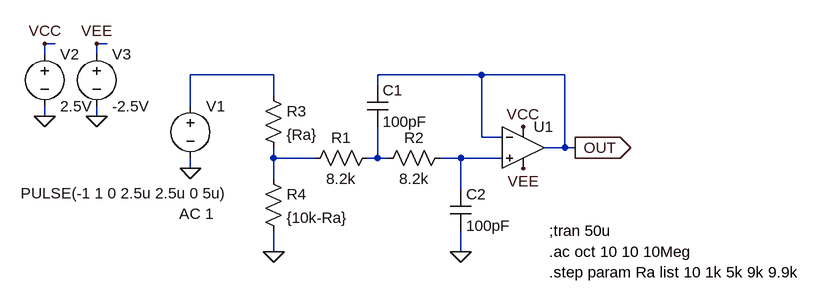
[diagram p0: schematic 2nd VCVS with POT.asc]
2nd VCVS with POT.asc, the LTspice schematic file:
Version 4
SHEET 1 880 680
WIRE -576 -64 -592 -64
WIRE -496 -64 -512 -64
WIRE -592 -48 -592 -64
WIRE -512 -48 -512 -64
WIRE -240 -16 -368 -16
WIRE 80 -16 -80 -16
WIRE 208 -16 80 -16
WIRE -80 0 -80 -16
WIRE -240 16 -240 -16
WIRE -368 32 -368 -16
WIRE -592 48 -592 32
WIRE -512 48 -512 32
WIRE 80 80 80 -16
WIRE 112 80 80 80
WIRE 208 96 208 -16
WIRE 208 96 176 96
WIRE 224 96 208 96
WIRE -240 112 -240 96
WIRE -176 112 -240 112
WIRE -80 112 -80 64
WIRE -80 112 -96 112
WIRE -64 112 -80 112
WIRE 48 112 16 112
WIRE 112 112 48 112
WIRE -368 128 -368 112
WIRE -240 144 -240 112
WIRE 48 160 48 112
WIRE -240 256 -240 224
WIRE 48 256 48 224
FLAG -368 128 0
FLAG 48 256 0
FLAG -592 48 0
FLAG -512 48 0
FLAG -592 -64 VCC
FLAG -512 -64 VEE
FLAG 144 64 VCC
FLAG 144 128 VEE
FLAG 224 96 OUT
IOPIN 224 96 Out
FLAG -240 256 0
SYMBOL Opamps\\UniversalOpamp2 144 96 R0
SYMATTR InstName U1
SYMBOL res -80 96 R90
WINDOW 0 0 56 VBottom 2
WINDOW 3 32 56 VTop 2
SYMATTR InstName R1
SYMATTR Value 8.2k
SYMBOL res 32 96 R90
WINDOW 0 0 56 VBottom 2
WINDOW 3 32 56 VTop 2
SYMATTR InstName R2
SYMATTR Value 8.2k
SYMBOL cap -96 0 R0
SYMATTR InstName C1
SYMATTR Value 100pF
SYMBOL cap 32 160 R0
SYMATTR InstName C2
SYMATTR Value 100pF
SYMBOL voltage -368 16 R0
WINDOW 123 -17 182 Left 2
WINDOW 39 0 0 Left 2
WINDOW 3 -261 150 Left 2
SYMATTR Value2 AC 1
SYMATTR Value PULSE(-1 1 0 2.5u 2.5u 0 5u)
SYMATTR InstName V1
SYMBOL voltage -592 -64 R0
WINDOW 123 0 0 Left 2
WINDOW 39 0 0 Left 2
SYMATTR InstName V2
SYMATTR Value 2.5V
SYMBOL voltage -512 -64 R0
WINDOW 123 0 0 Left 2
WINDOW 39 0 0 Left 2
SYMATTR InstName V3
SYMATTR Value -2.5V
SYMBOL res -256 0 R0
SYMATTR InstName R3
SYMATTR Value {Ra}
SYMBOL res -256 128 R0
SYMATTR InstName R4
SYMATTR Value {10k-Ra}
TEXT 184 224 Left 2 !;tran 50u
TEXT 184 256 Left 2 !.ac oct 10 10 10Meg
TEXT 184 288 Left 2 !.step param Ra list 10 1k 5k 9k 9.9k

The netlist it stands for:
* 2nd VCVS with POT.asc
XU1 N004 OUT VCC VEE OUT level.2 Avol=1Meg GBW=10Meg Slew=10Meg ilimit=25m rail=0 Vos=0 phimargin=45 en=0 enk=0 in=0 ink=0 Rin=500Meg  ; pins IN+ IN- V+ V- OUT
R1 N003 N002 8.2k
R2 N004 N003 8.2k
C1 OUT N003 100pF
C2 N004 0 100pF
V1 N001 0 PULSE(-1 1 0 2.5u 2.5u 0 5u) AC 1
V2 VCC 0 2.5V
V3 VEE 0 -2.5V
R3 N001 N002 {Ra}
R4 N002 0 {10k-Ra}
;tran 50u
.ac oct 10 10 10Meg
.step param Ra list 10 1k 5k 9k 9.9k
.lib UniversalOpamps2.sub
.backanno
.end